# Altium schematic sheet 1VD, 1.5VD, 1.8VD, 3.3VD, 3.3VA.SchDoc
size 381 x 241 mm; SheetNumber: 3; SheetTotal: 7
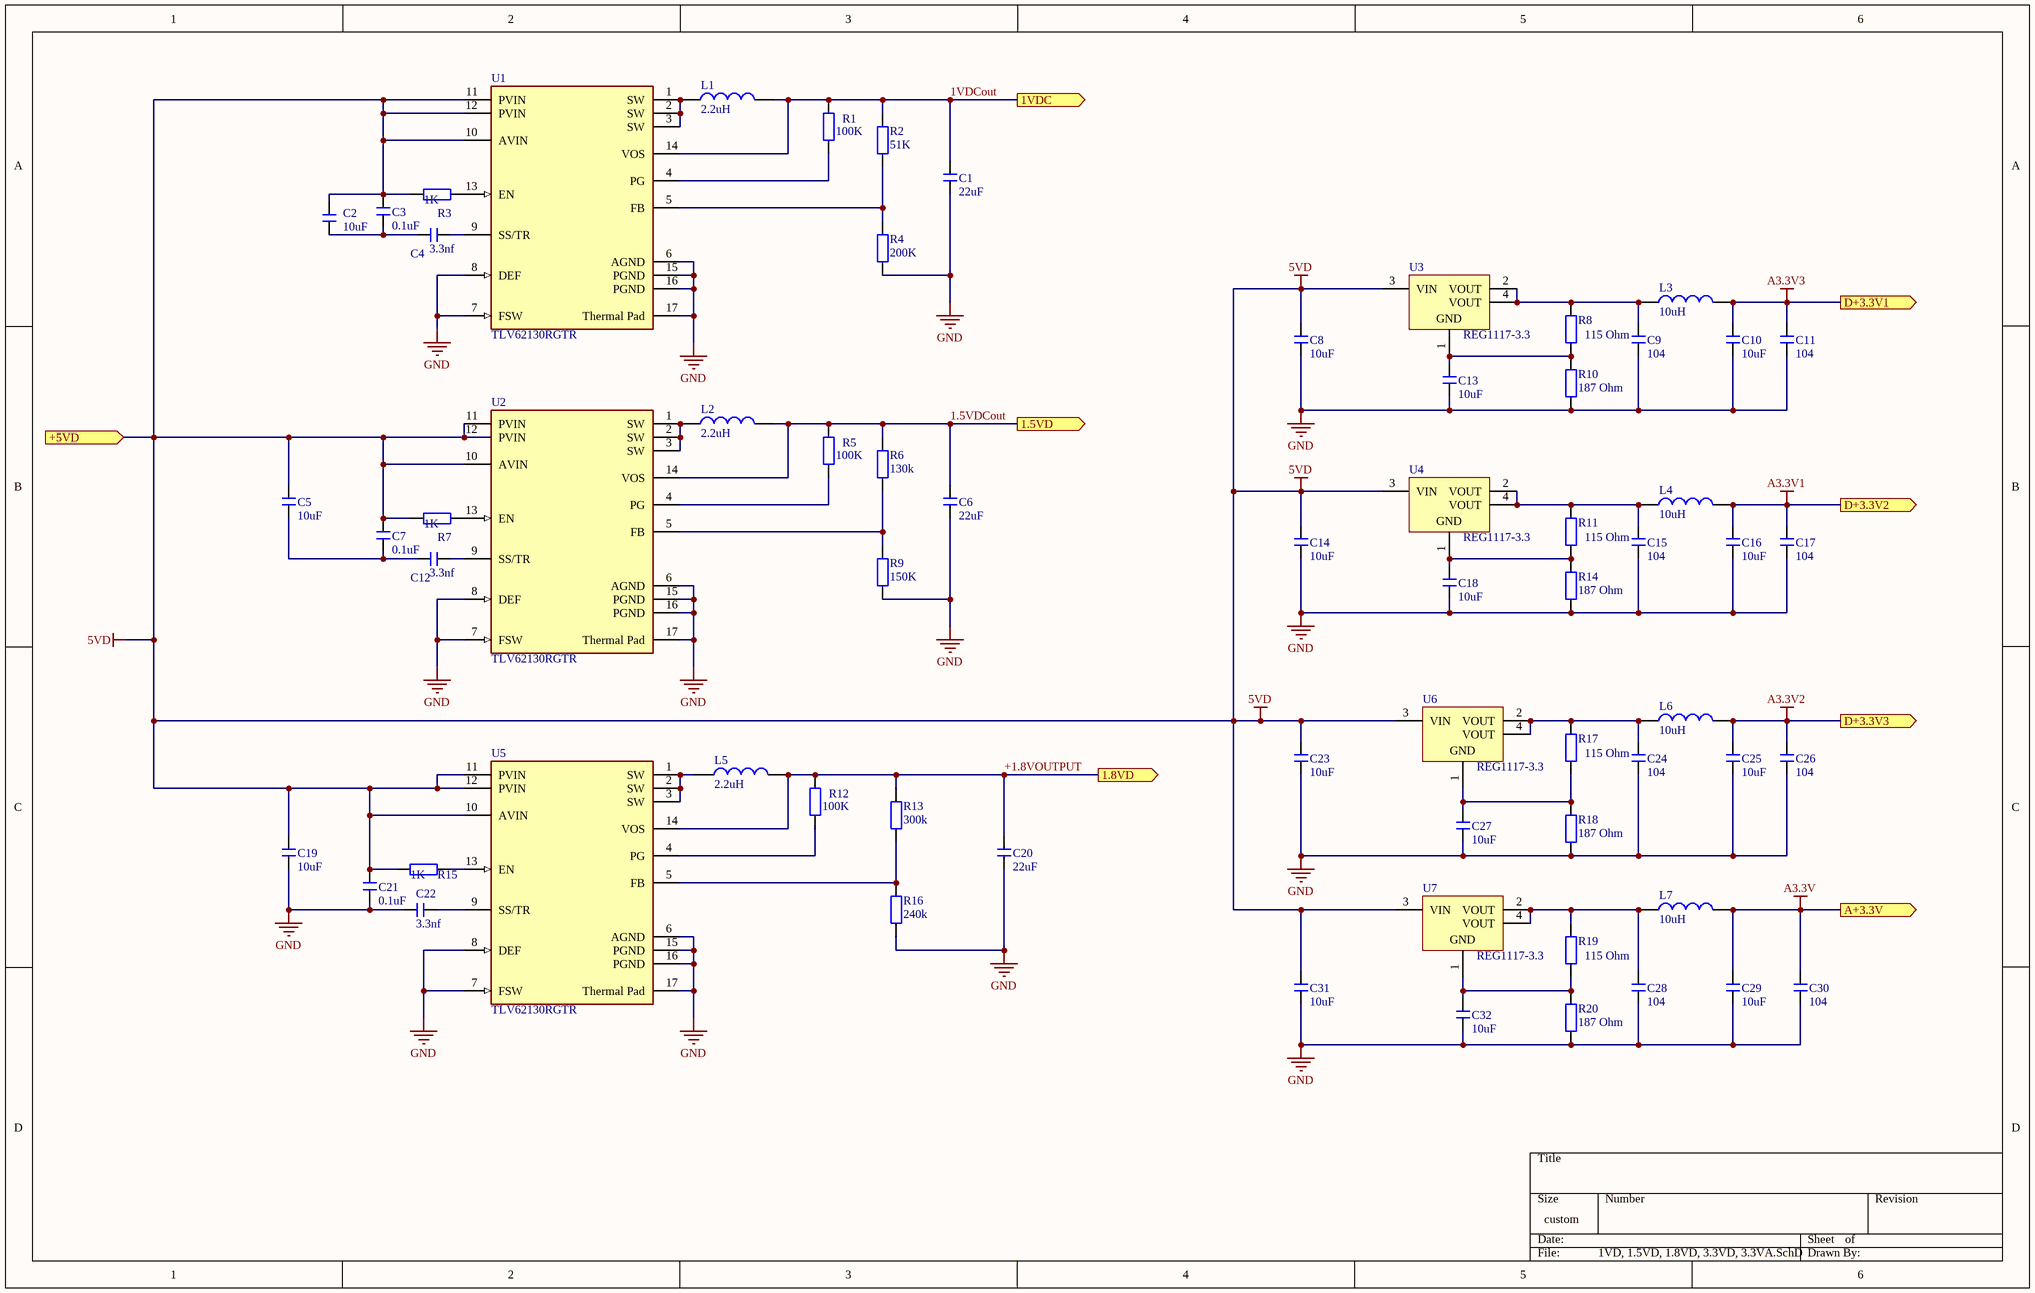
[diagram p0: 1VD, 1.5VD, 1.8VD, 3.3VD, 3.3VA.SchDoc]

## Parts
C1  22uF  [C 0805_L]
C2  10uF  [C 0805_L]
C3  0.1uF  [C 0805_L]
C4  3.3nf  [C 0805_L]
C5  10uF  [C 0805_L]
C6  22uF  [C 0805_L]
C7  0.1uF  [C 0805_L]
C8  10uF  [C 0805_L]
C9  104  [C 0805_L]
C10  10uF  [C 0805_L]
C11  104  [C 0805_L]
C12  3.3nf  [C 0805_L]
C13  10uF  [C 0805_L]
C14  10uF  [C 0805_L]
C15  104  [C 0805_L]
C16  10uF  [C 0805_L]
C17  104  [C 0805_L]
C18  10uF  [C 0805_L]
C19  10uF  [C 0805_L]
C20  22uF  [C 0805_L]
C21  0.1uF  [C 0805_L]
C22  3.3nf  [C 0805_L]
C23  10uF  [C 0805_L]
C24  104  [C 0805_L]
C25  10uF  [C 0805_L]
C26  104  [C 0805_L]
C27  10uF  [C 0805_L]
C28  104  [C 0805_L]
C29  10uF  [C 0805_L]
C30  104  [C 0805_L]
C31  10uF  [C 0805_L]
C32  10uF  [C 0805_L]
L1  2.2uH  [L 0805]
L2  2.2uH  [L 0805]
L3  10uH  [AL0307]
L4  10uH  [AL0307]
L5  2.2uH  [L 0805]
L6  10uH  [AL0307]
L7  10uH  [AL0307]
R1  100K  [R 0805_L]
R2  51K  [R 0805_L]
R3  1K  [R 0805_L]
R4  200K  [R 0805_L]
R5  100K  [R 0805_L]
R6  130k  [R 0805_L]
R7  1K  [R 0805_L]
R8  115 Ohm  [R 0805_L]
R9  150K  [R 0805_L]
R10  187 Ohm  [R 0805_L]
R11  115 Ohm  [R 0805_L]
R12  100K  [R 0805_L]
R13  300k  [R 0805_L]
R14  187 Ohm  [R 0805_L]
R15  1K  [R 0805_L]
R16  240k  [R 0805_L]
R17  115 Ohm  [R 0805_L]
R18  187 Ohm  [R 0805_L]
R19  115 Ohm  [R 0805_L]
R20  187 Ohm  [R 0805_L]
U1  TLV62130RGTR  [FP-RGT0016C-IPC_A]
U2  TLV62130RGTR  [FP-RGT0016C-IPC_A]
U3  REG1117-3.3  [DCY0004A_M]
U4  REG1117-3.3  [DCY0004A_M]
U5  TLV62130RGTR  [FP-RGT0016C-IPC_A]
U6  REG1117-3.3  [DCY0004A_M]
U7  REG1117-3.3  [DCY0004A_M]

## Ports
1.5VD (out, see POWER_BOARD[2A]), 1.8VD (out, see POWER_BOARD[2A]), 1VDC (out, see POWER_BOARD[2A]), +5VD (in, see POWER_BOARD[1A], 5VD_and_5VDC_and_12V[3B], VTTVREF[1B]), A+3.3V (out, see POWER_BOARD[2B]), D+3.3V1 (out, see POWER_BOARD[2B]), D+3.3V2 (out, see POWER_BOARD[2B]), D+3.3V3 (out, see POWER_BOARD[2B])

## Nets
5VD: C2.2 C3.2 C5.2 C7.2 C8.2 C14.2 C19.2 C21.2 C23.2 C31.2 R3.1 R7.1 R15.1 U1.10(AVIN) U1.11(PVIN) U1.12(PVIN) U2.10(AVIN) U2.11(PVIN) U2.12(PVIN) U3.3(VIN) U4.3(VIN) U5.10(AVIN) U5.11(PVIN) U5.12(PVIN) U6.3(VIN) U7.3(VIN) ; port +5VD
A3.3V: C29.2 C30.2 L7.2 ; port A+3.3V
A3.3V1: C16.2 C17.2 L4.2 ; port D+3.3V2
A3.3V2: C25.2 C26.2 L6.2 ; port D+3.3V3
A3.3V3: C10.2 C11.2 L3.2 ; port D+3.3V1
GND: C1.1 C6.1 C8.1 C9.1 C10.1 C11.1 C13.1 C14.1 C15.1 C16.1 C17.1 C18.1 C19.1 C20.1 C21.1 C22.1 C23.1 C24.1 C25.1 C26.1 C27.1 C28.1 C29.1 C30.1 C31.1 C32.1 R4.1 R9.1 R10.1 R14.1 R16.1 R18.1 R20.1 U1.6(AGND) U1.7(FSW) U1.8(DEF) U1.15(PGND) U1.16(PGND) U1.17(Thermal_Pad) U2.6(AGND) U2.7(FSW) U2.8(DEF) U2.15(PGND) U2.16(PGND) U2.17(Thermal_Pad) U5.6(AGND) U5.7(FSW) U5.8(DEF) U5.15(PGND) U5.16(PGND) U5.17(Thermal_Pad)
1.5VDCout: C6.2 L2.2 R5.2 R6.2 U2.14(VOS) ; port 1.5VD
1VDCout: C1.2 L1.2 R1.2 R2.2 U1.14(VOS) ; port 1VDC
+1.8VOUTPUT: C20.2 L5.2 R12.2 R13.2 U5.14(VOS) ; port 1.8VD
NetC2_1: C2.1 C3.1 C4.1
NetC4_2: C4.2 U1.9(SS/TR)
NetC5_1: C5.1 C7.1 C12.1
NetC9_2: C9.2 L3.1 R8.2 U3.2(VOUT) U3.4(VOUT)
NetC12_2: C12.2 U2.9(SS/TR)
NetC13_2: C13.2 R8.1 R10.2 U3.1(GND)
NetC15_2: C15.2 L4.1 R11.2 U4.2(VOUT) U4.4(VOUT)
NetC18_2: C18.2 R11.1 R14.2 U4.1(GND)
NetC22_2: C22.2 U5.9(SS/TR)
NetC24_2: C24.2 L6.1 R17.2 U6.2(VOUT) U6.4(VOUT)
NetC27_2: C27.2 R17.1 R18.2 U6.1(GND)
NetC28_2: C28.2 L7.1 R19.2 U7.2(VOUT) U7.4(VOUT)
NetC32_2: C32.2 R19.1 R20.2 U7.1(GND)
NetL1_1: L1.1 U1.1(SW) U1.2(SW) U1.3(SW)
NetL2_1: L2.1 U2.1(SW) U2.2(SW) U2.3(SW)
NetL5_1: L5.1 U5.1(SW) U5.2(SW) U5.3(SW)
NetR1_1: R1.1 U1.4(PG)
NetR2_1: R2.1 R4.2 U1.5(FB)
NetR3_2: R3.2 U1.13(EN)
NetR5_1: R5.1 U2.4(PG)
NetR6_1: R6.1 R9.2 U2.5(FB)
NetR7_2: R7.2 U2.13(EN)
NetR12_1: R12.1 U5.4(PG)
NetR13_1: R13.1 R16.2 U5.5(FB)
NetR15_2: R15.2 U5.13(EN)

## Library data of the parts
C1 C6 = C: 贴片电容 22 µF, 6.3 V, Ceramic, 0805 Standard; BOM名称: 无极性贴片电容; 淘宝ID: 封装库来自淘宝 ID：黄晶宝石; 联系售后，技术支持: https://shop463601444.taobao.com; 唯一出售店铺网址: https://shop463601444.taobao.com
C2 C5 = C: 贴片电容 10 µF, 25 V, Ceramic, 1210 Standard; BOM名称: 无极性贴片电容; 淘宝ID: 封装库来自淘宝 ID：黄晶宝石; 联系售后，技术支持: https://shop463601444.taobao.com; 唯一出售店铺网址: https://shop463601444.taobao.com
C3 = C: 贴片电容 / C7 0.1 µF, 25V, Ceramic, 0603; BOM名称: 无极性贴片电容; 淘宝ID: 封装库来自淘宝 ID：黄晶宝石; 联系售后，技术支持: https://shop463601444.taobao.com; 唯一出售店铺网址: https://shop463601444.taobao.com
C4 C12 C22 = C: 贴片电容 3300 pF, 25 V, Ceramic, 0603; BOM名称: 无极性贴片电容; 淘宝ID: 封装库来自淘宝 ID：黄晶宝石; 联系售后，技术支持: https://shop463601444.taobao.com; 唯一出售店铺网址: https://shop463601444.taobao.com
C7 = C: 贴片电容 0.1 µF, 25V, Ceramic, 0603; BOM名称: 无极性贴片电容; 淘宝ID: 封装库来自淘宝 ID：黄晶宝石; 联系售后，技术支持: https://shop463601444.taobao.com; 唯一出售店铺网址: https://shop463601444.taobao.com
C8-C11 C13-C18 C21 C23-C32 = C: 贴片电容; BOM名称: 无极性贴片电容; 淘宝ID: 封装库来自淘宝 ID：黄晶宝石; 联系售后，技术支持: https://shop463601444.taobao.com; 唯一出售店铺网址: https://shop463601444.taobao.com
C19 = C: 贴片电容 10 µF, 25 V, Ceramic, 1210; BOM名称: 无极性贴片电容; 淘宝ID: 封装库来自淘宝 ID：黄晶宝石; 联系售后，技术支持: https://shop463601444.taobao.com; 唯一出售店铺网址: https://shop463601444.taobao.com
C20 = C: 贴片电容 22 µF, 6.3 V, Ceramic, 0805; BOM名称: 无极性贴片电容; 淘宝ID: 封装库来自淘宝 ID：黄晶宝石; 联系售后，技术支持: https://shop463601444.taobao.com; 唯一出售店铺网址: https://shop463601444.taobao.com
L1 L2 = L: 小功率贴片电感 2.2 µH, 0.165 × 0.165 in XFL4020-222MEB, Coilcraft; 淘宝ID: 封装库来自淘宝 ID：黄晶宝石; 封装库来自淘宝卖家 ID：黄晶宝石: 其他店铺购入均为盗版，不享受售后技术支持服务，请立即申请退款; BOM名称: 小功率贴片电感; 联系售后: https://shop463601444.taobao.com
L3 L4 L6 L7 = L-AL: 色环电感; 淘宝ID: 封装库来自淘宝 ID：黄晶宝石; BOM名称: 色环电感; 学习资源: https://shop463601444.taobao.com
L5 = L: 小功率贴片电感; 淘宝ID: 封装库来自淘宝 ID：黄晶宝石; 封装库来自淘宝卖家 ID：黄晶宝石: 其他店铺购入均为盗版，不享受售后技术支持服务，请立即申请退款; BOM名称: 小功率贴片电感; 联系售后: https://shop463601444.taobao.com
R1 R5 = R: 贴片电阻 100 kΩ, Chip, 0603, 1/16W, 1%; 版权归属: 来自淘宝 ID：黄晶宝石; 封装库来自淘宝卖家 ID：黄晶宝石: 其他店铺购入均为盗版，不享受售后技术支持服务，请立即申请退款; BOM名称: 贴片电阻; 联系售后: https://shop463601444.taobao.com
R2 R4 R6 R8-R14 R16-R20 = R: 贴片电阻; 版权归属: 来自淘宝 ID：黄晶宝石; 封装库来自淘宝卖家 ID：黄晶宝石: 其他店铺购入均为盗版，不享受售后技术支持服务，请立即申请退款; BOM名称: 贴片电阻; 联系售后: https://shop463601444.taobao.com
R3 R7 R15 = R: 贴片电阻R1 IMPORTANT, TO PREVENT HV DAMAGE; BOM名称: 贴片电阻; 版权归属: 来自淘宝 ID：黄晶宝石; 封装库来自淘宝卖家 ID：黄晶宝石: 其他店铺购入均为盗版，不享受售后技术支持服务，请立即申请退款; 联系售后: https://shop463601444.taobao.com
U1 U2 U5 = CMP-04918-000039-1: IC REG BUCK ADJUSTABLE 3A 16QFN; Manufacturer: Texas Instruments; Min Supply Voltage: 3V; Max Junction Temp: +125°C; Output Type: AdjustableProgrammable; Number Of Outputs: 1; Nominal Supply Current: 19uA; Standoff Height: 0mm; Max Supply Voltage: 17V; Switching Frequency: 1.25/2.5MHz; Max Duty Cycle: 100%; Output Voltage: 0.9-5.5V; ComponentLink2Description: Datasheet; Category: IC; Manufacturer Part Number: TLV62130RGTR; Mouser Description: Switching Voltage Regulators 4-17V 3A Step-Down Converter; Output Current: 3A; Ambient Temperature Range Low: -40°C; Package: RGT0016C; Lead Free: Yes; Temperature Range Low: -40°C; Digikey Description: IC REG BUCK ADJUSTABLE 3A 16QFN; Height: 1mm; Device Class L3: Voltage Regulators - Switching; Device Class L1: Integrated Circuits (ICs); Switching Topology: Buck; Ambient Temperature Range High: +85°C; RoHS: TRUE; Ipc Land Pattern Name: QFN50P300X300X100-16; Temperature: -40°C to +85°C; Octopart: https://octopart.com/tlv62130rgtr-texas+instruments-21766117; Device Class L2: Power Management ICs; Temperature Range High: +85°C; Automotive: No; ComponentLink2URL: http://www.ti.com/lit/ds/symlink/tlv62130.pdf
U3 U4 U6 U7 = CMP-0395-00549-2: Single Output LDO, 800 mA, Fixed 3.3 V Output, 3.8 to 15 V Input, with Internal Current Limiting, 4-pin SOT-223 (DCY), -40 to 125 degC, Green (RoHS & no Sb/Br); Manufacturer: Texas Instruments; Vout Adj(Max)(V): 3.3; Vin(Max)(V): 15; Iq(Typ)(mA): 4; Iout(Max)(A): 0.8; Vdo(Typ)(mV): 1100; Vin(Min)(V): 3.8; SubFamily: Single Channel LDO; Rating: Catalog; Fixed Output Options(V): 5; ComponentLink1Description: Manufacturer URL; Eco-Plan: Green (RoHS & no Sb/Br); PackageReference: DCY0004A; Mounting Technology: Surface Mount; ComponentLink3Description: Package Specification; Vout Adj(Min)(V): 3.3; ComponentLink2URL: http://www.ti.com/general/docs/lit/getliterature.tsp?genericPartNumber=REG1117-33&fileType=pdf; PackageVersion: 4202506/B; ComponentLink3URL: http://www.ti.com/litv/pdf/mpds094a; Code_JEDEC: TO-261; ComponentLink1URL: http://www.ti.com/; ComponentLink2Description: Datasheet; PartNumber: REG1117-3.3; DatasheetVersion: SBVS001D; PackageDescription: 4-Pin Plastic Small Outline, Body 3.5 x 6.5 mm, Pitch 2.3 mm